# Altium project BEE-1012 PAY-IF V110.PrjPcb (part 8 of 8)
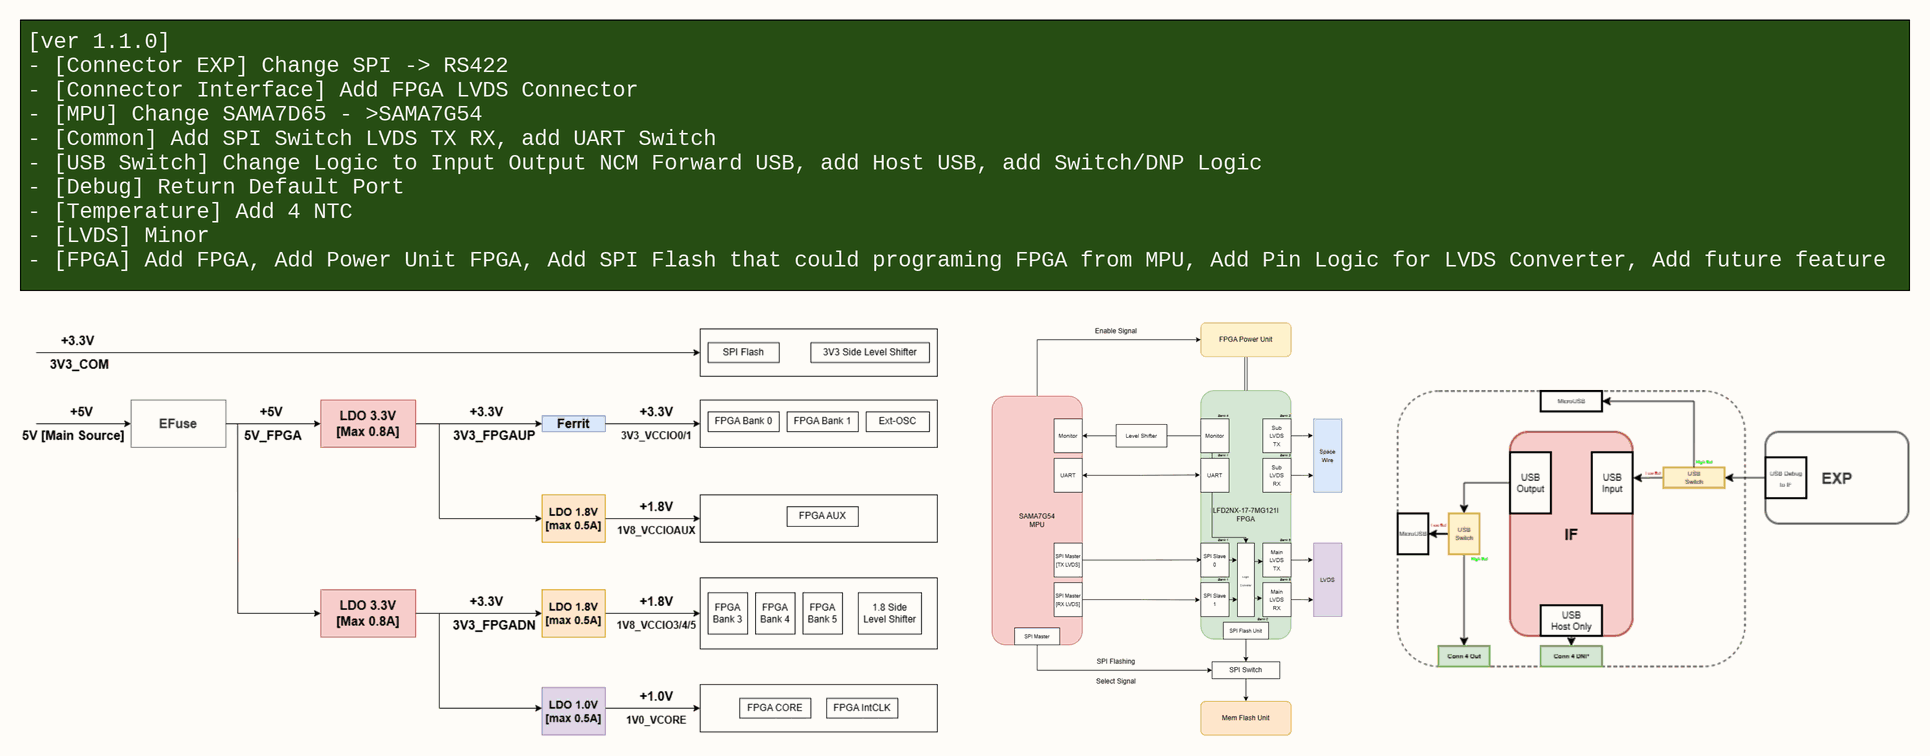
[diagram p41: ChangeNote.SchDoc]

## Nets that join several sheets
1V8_VCCAUX: FPGA_POWER (11 pins), FPGA_PART1 (U35.C6 U35.D9 U35.F3), FPGA_PART2 (U35.H3 U35.H8)
1V8_VCCIO3/4/5: FPGA_POWER (10 pins), FPGA_PART1 (U35.E8), FPGA_PART2 (8 pins)
1V_VCORE: FPGA_POWER (9 pins), FPGA_PART1 (U35.E4 U35.G6), FPGA_PART2 (U35.C10)
3.3_VBAT: Power (C184.1 J11.1), SAMA7G54_MPU (R34.1), RTC (C154.2 U15.9)
3V3_COM: Power (C186.2 R256.2 U28.2 U28.4), CONNECTOR_INTERFACE (11 pins), COMM (10 pins), USB_SWITCH (C172.2 C173.2 U24.1 U25.1), DEBUG_CONSOLE (C138.2 J10.1 R193.1 R194.1), TEMP (12 pins), RTC (7 pins), WATCHDOG (C155.2 U16.1), LVDS (12 pins), CAN_PHY (6 pins), IMU (9 pins), RS422 (6 pins), FPGA_PART2 (C234.2 U37.23 U37.24), FPGA_extFLASH (11 pins)
3V3_eMMC: Power (C188.2 R257.2 U29.2 U29.4), SDCARD_FLASH (14 pins), eMMC (38 pins)
3V3_VCCIO0/1: FPGA_POWER (5 pins), FPGA_PART1 (11 pins), FPGA_PART2 (C233.2 FB2.2 R354.2), FPGA_extFLASH (5 pins)
5V: Power (10 pins), SAMA7G54_PMIC (13 pins), SAMA7G54_PIO (R152.1), USB_SWITCH (SB4.1), FPGA_POWER (6 pins)
5V_FPGA: POWER_MEASUREMENT (R388.2), FPGA_POWER (C193.2 C237.2 U31.3 U40.3)
5V_FPGA_efuse: POWER_MEASUREMENT (R388.1), FPGA_POWER (8 pins)
12V: Power (C181.2 U27.7), POWER_MEASUREMENT (R387.2)
12V_CONN: Power (8 pins), CONNECTOR_EXP (J2-2.1 J2-2.2 J2-2.3)
12V_efuse: Power (8 pins), POWER_MEASUREMENT (R387.1)
GND: Power (36 pins), POWER_MEASUREMENT (6 pins), CONNECTOR_EXP (7 pins), CONNECTOR_INTERFACE (30 pins), SAMA7G54_PMIC (30 pins), SAMA7G54_MPU (115 pins), SAMA7G54_PIO (10 pins), SAMA7G54_DDR3L (84 pins), SDCARD_FLASH (13 pins), eMMC (30 pins), COMM (12 pins), USB_SWITCH (11 pins), DEBUG_CONSOLE (20 pins), TEMP (23 pins), RTC (C153.1 C154.1 U15.6), WATCHDOG (C155.1 R216.2 R217.2 U16.2), LVDS (12 pins), CAN_PHY (10 pins), IMU (9 pins), RS422 (6 pins), BUTTON_LED (D3.1 D4.1 D5.1), MOUNTING_HOLE (12 pins), FPGA_POWER (60 pins), FPGA_PART1 (16 pins), FPGA_PART2 (26 pins), FPGA_extFLASH (6 pins)
VDD_3V3: POWER_MEASUREMENT (11 pins), SAMA7G54_PMIC (18 pins), SAMA7G54_MPU (7 pins), SAMA7G54_PIO (8 pins), SDCARD_FLASH (C130.2 DNP/U6.8 JP9.1 R174.2)
VDD_3V3_MPU: SAMA7G54_PMIC (5 pins), SAMA7G54_MPU (36 pins)
VDDCORE: SAMA7G54_PMIC (R12.2 TP3.0), SAMA7G54_MPU (30 pins)
VDDCPU: SAMA7G54_PMIC (R15.2 TP5.0), SAMA7G54_MPU (11 pins)
VDDIODDR: SAMA7G54_PMIC (R18.2 TP10.0), SAMA7G54_DDR3L (73 pins)
_PD09: SAMA7G54_PMIC (R11.1 U1.1), SAMA7G54_PIO (U3.D19)
ADC_TEMP1: SAMA7G54_PIO (R103.1), TEMP (C149.2 R202.2)
ADC_TEMP2: SAMA7G54_PIO (R105.1), TEMP (C145.2 R196.2)
ADC_TEMP3: SAMA7G54_PIO (R145.1), TEMP (C146.2 R197.2)
ADC_TEMP4: SAMA7G54_PIO (R146.1), TEMP (C152.2 R203.2)
ADC_TEMP_1: SAMA7G54_PIO (R144.1), TEMP (C140.2 R195.2)
BNO_INT: SAMA7G54_PIO (R395.1), IMU (U41.14)
CAN_AX_H: CONNECTOR_INTERFACE (J12.07 R264.1), CAN_PHY (R226#1.1 U22#1.7)
CAN_AX_L: CONNECTOR_INTERFACE (J12.08 R263.1), CAN_PHY (R228#1.2 U22#1.6)
CAN_H_main: CONNECTOR_EXP (J2-2.9), CONNECTOR_INTERFACE (H1.03 R264.2), CAN_PHY (R222.1 U21.7)
CAN_L_main: CONNECTOR_EXP (J2-2.8), CONNECTOR_INTERFACE (H1.01 R263.2), CAN_PHY (R224.2 U21.6)
COM_UART_RX: SAMA7G54_PIO (R148.1), COMM (U9.3)
COM_UART_SEL_CHANNEL_A: SAMA7G54_PIO (R92.1), COMM (R182.1 U9.10)
COM_UART_SEL_CHANNEL_B: SAMA7G54_PIO (R84.1), COMM (R183.1 U9.9)
COM_UART_TX: SAMA7G54_PIO (R147.1), COMM (U9.13)
eFUSE_ILIM_5V_FPGA: SAMA7G54_PIO (R138.1), FPGA_POWER (R313.2 U30.9)
EXP_2_CONN_USB_N: CONNECTOR_EXP (R262.2), CONNECTOR_INTERFACE (R295.1)
EXP_2_CONN_USB_P: CONNECTOR_EXP (R261.2), CONNECTOR_INTERFACE (R296.1)
EXP_2_IF_USB_N: CONNECTOR_EXP (R260.2), USB_SWITCH (U25.4)
EXP_2_IF_USB_P: CONNECTOR_EXP (R259.2), USB_SWITCH (U25.3)
FLASH_SPI_MD2: FPGA_PART1 (U35.C5), FPGA_extFLASH (R373.1)
FLASH_SPI_MD3: FPGA_PART1 (U35.C9), FPGA_extFLASH (R372.2)
FPGA_DOWNLOAD_DONE: SAMA7G54_PIO (R87.1), FPGA_PART2 (U35.D10), FPGA_extFLASH (R363.1 R364.2)
FPGA_DOWNLOAD_INITN: SAMA7G54_PIO (R79.1), FPGA_PART1 (U35.B4), FPGA_extFLASH (D23.1 R365.2)
FPGA_DOWNLOAD_PROGRAMN: SAMA7G54_PIO (R82.1), FPGA_PART1 (U35.C4), FPGA_extFLASH (R362.1)
FPGA_FLASH_SPI_MCLK: FPGA_PART2 (U35.D11), FPGA_extFLASH (U39.6)
FPGA_FLASH_SPI_MCSN: FPGA_PART1 (U35.D7), FPGA_extFLASH (R376.1 U39.3)
FPGA_FLASH_SPI_MISO/MD1: FPGA_PART1 (U35.D5), FPGA_extFLASH (U39.13)
FPGA_FLASH_SPI_MOSI/MD0: FPGA_PART1 (U35.D6), FPGA_extFLASH (U39.10)
FPGA_LVDS_RXC_N: CONNECTOR_INTERFACE (J15.9), FPGA_PART1 (R329.1 R330.1)
FPGA_LVDS_RXC_P: CONNECTOR_INTERFACE (J15.8), FPGA_PART1 (R329.2 R331.1)
FPGA_LVDS_RXD_N: CONNECTOR_INTERFACE (J15.4), FPGA_PART1 (R334.1 R335.2)
FPGA_LVDS_RXD_P: CONNECTOR_INTERFACE (J15.3), FPGA_PART1 (R333.1 R335.1)
FPGA_LVDS_TXC_N: CONNECTOR_INTERFACE (J15.7), FPGA_PART1 (R332.1)
FPGA_LVDS_TXC_P: CONNECTOR_INTERFACE (J15.6), FPGA_PART1 (R336.1)
FPGA_LVDS_TXD_N: CONNECTOR_INTERFACE (J15.2), FPGA_PART1 (R338.1)
FPGA_LVDS_TXD_P: CONNECTOR_INTERFACE (J15.1), FPGA_PART1 (R337.1)
FPGA_SPI_RX_CLK: COMM (U11.6), FPGA_PART1 (U35.C2)
FPGA_SPI_RX_MISO: COMM (U11.13), FPGA_PART1 (U35.D1)
FPGA_SPI_RX_MOSI: COMM (U11.10), FPGA_PART1 (U35.B2)
FPGA_SPI_TX_CLK: COMM (U10#1.6), FPGA_PART1 (U35.E1)
FPGA_SPI_TX_MISO: COMM (U10#1.13), FPGA_PART1 (U35.F1)
FPGA_SPI_TX_MOSI: COMM (U10#1.10), FPGA_PART1 (U35.E2)
FPGA_UART_RX: SAMA7G54_PIO (R139.1), FPGA_PART1 (U35.D8)
FPGA_UART_TX: SAMA7G54_PIO (R141.1), FPGA_PART1 (U35.C3)
I2C_SCL_EXP_PC104: CONNECTOR_EXP (J2-1.6), CONNECTOR_INTERFACE (R292.1 R380.1)
I2C_SDA_EXP_PC104: CONNECTOR_EXP (J2-1.5), CONNECTOR_INTERFACE (R289.1 R379.1)
IF_OUT_CONN_USB_N: CONNECTOR_INTERFACE (R291.1), USB_SWITCH (U24.6)
IF_OUT_CONN_USB_P: CONNECTOR_INTERFACE (R294.1), USB_SWITCH (U24.7)
LPM: SAMA7G54_PMIC (Q1.1 R3.1 R401.1), SAMA7G54_MPU (R402.1)
LVDS_SPI_RX_CLK: SAMA7G54_PIO (R101.1), COMM (U11.7)
LVDS_SPI_RX_CSN: SAMA7G54_PIO (R42.1), COMM (U11.4)
LVDS_SPI_RX_MISO: SAMA7G54_PIO (R45.1), COMM (U11.12)
LVDS_SPI_RX_MOSI: SAMA7G54_PIO (R47.1), COMM (U11.9)
LVDS_SPI_TX_CLK: SAMA7G54_PIO (R54.1), COMM (U10#1.7)
LVDS_SPI_TX_CSN: SAMA7G54_PIO (R57.1), COMM (U10#1.4)
LVDS_SPI_TX_MISO: SAMA7G54_PIO (R51.1), COMM (U10#1.12)
LVDS_SPI_TX_MOSI: SAMA7G54_PIO (R48.1), COMM (U10#1.9)
MCP16502_HPM: SAMA7G54_PMIC (R4.1), SAMA7G54_PIO (R78.1 R152.2 R155.1)
NetC72_1: SAMA7G54_PMIC (U1.24), SAMA7G54_MPU (C72.1 JP3.1)
NetC75_2: SAMA7G54_PMIC (R10.1 U1.2), SAMA7G54_MPU (R37.1 U3.J7), SAMA7G54_PIO (C75.2 R154.1), WATCHDOG (R213.2), IMU (U41.11)
NetD8_1: Power (D8.1 R248.1 U26.1), CONNECTOR_EXP (R258.2), CONNECTOR_INTERFACE (D15.1)
NetJ12_05: CONNECTOR_INTERFACE (J12.05 R297.1), SAMA7G54_PIO (R129.1)
NetJ12_06: CONNECTOR_INTERFACE (J12.06 R298.1), SAMA7G54_PIO (R131.1)
NetQ1_3: SAMA7G54_PMIC (Q1.3 R16.2), SAMA7G54_MPU (Y2.1)
NetR7_2: SAMA7G54_PMIC (R7.2 U2.1), SAMA7G54_PIO (R118.1)
NetR64_1: SAMA7G54_PIO (R64.1), RTC (R209.2 U15.7)
NetR67_1: SAMA7G54_PIO (R67.1), WATCHDOG (R214.2)
NetR91_1: CONNECTOR_INTERFACE (R268.2), SAMA7G54_PIO (R91.1)
NetR95_1: CONNECTOR_INTERFACE (R301.1), SAMA7G54_PIO (R95.1)
NetR96_1: CONNECTOR_INTERFACE (R300.1), SAMA7G54_PIO (R96.1)
NetR97_1: CONNECTOR_INTERFACE (R303.1), SAMA7G54_PIO (R97.1)
NetR98_1: CONNECTOR_INTERFACE (R304.1), SAMA7G54_PIO (R98.1)
NetR111_1: SAMA7G54_PIO (R111.1), WATCHDOG (R215.2)
NetR116_1: SAMA7G54_PIO (R116.1), RTC (R208.2 U15.3)
NetR136_1: Power (R250.1 U26.9), SAMA7G54_PIO (R136.1)
NetR140_1: CONNECTOR_INTERFACE (R290.2 R299.1 R382.1), SAMA7G54_PIO (R140.1)
NetR142_1: CONNECTOR_INTERFACE (R293.2 R302.1 R383.1), SAMA7G54_PIO (R142.1)
NetR385_2: POWER_MEASUREMENT (R385.2 U42.1), SAMA7G54_PIO (R396.1)
NetU10#1_5: COMM (U10#1.5), LVDS (U18.5)
NetU10#1_11: COMM (U10#1.11), LVDS (U17.5)
NetU11_5: COMM (U11.5), LVDS (U20.5)
NetU11_14: COMM (U11.14), LVDS (U19.5)
OSC_LVDS_ENABLE: FPGA_PART1 (U35.B3), FPGA_PART2 (R354.1 U36.1)
PHY_LVDS_RXC_N: CONNECTOR_INTERFACE (J5.9), LVDS (R221.2 U20.4)
PHY_LVDS_RXC_P: CONNECTOR_INTERFACE (J5.8), LVDS (R221.1 U20.3)
PHY_LVDS_RXD_N: CONNECTOR_INTERFACE (J5.4), LVDS (R220.2 U19.4)
PHY_LVDS_RXD_P: CONNECTOR_INTERFACE (J5.3), LVDS (R220.1 U19.3)
PHY_LVDS_TXC_N: CONNECTOR_INTERFACE (J5.7), LVDS (U18.3)
PHY_LVDS_TXC_P: CONNECTOR_INTERFACE (J5.6), LVDS (U18.4)
PHY_LVDS_TXD_N: CONNECTOR_INTERFACE (J5.2), LVDS (U17.3)
PHY_LVDS_TXD_P: CONNECTOR_INTERFACE (J5.1), LVDS (U17.4)
POW_ONOFF_FPGA: SAMA7G54_PIO (R43.1), FPGA_POWER (R305.2 R310.1 U30.1)
RS_422_2_PC104_RX_N: CONNECTOR_EXP (J2-1.2), CONNECTOR_INTERFACE (R276.1 R277.1 R285.1)
RS_422_2_PC104_RX_P: CONNECTOR_EXP (J2-1.1), CONNECTOR_INTERFACE (R274.1 R278.1 R286.2)
RS_422_2_PC104_TX_N: CONNECTOR_EXP (J2-1.4), CONNECTOR_INTERFACE (R272.1 R273.1)
RS_422_2_PC104_TX_P: CONNECTOR_EXP (J2-1.3), CONNECTOR_INTERFACE (R270.1 R271.1)
RS_422_RX_N: CONNECTOR_INTERFACE (R267.1 R276.2), RS422 (R236.2 SB3.1 U23.10)
RS_422_RX_P: CONNECTOR_INTERFACE (R269.1 R278.2), RS422 (R236.1 SB2.1 U23.11)
RS_422_TX_N: CONNECTOR_INTERFACE (R266.1 R273.2), RS422 (R237.1 SB3.2 U23.9)
RS_422_TX_P: CONNECTOR_INTERFACE (R265.1 R271.2), RS422 (R237.2 SB2.2 U23.8)
SAM_BNO_RX: COMM (U9.4), IMU (U41.20)
SAM_BNO_TX: COMM (U9.11), IMU (U41.19)
SAM_HOST_UART_RXD: CONNECTOR_INTERFACE (J14#1.11), COMM (U9.1)
SAM_HOST_UART_TXD: CONNECTOR_INTERFACE (J14#1.12), COMM (U9.12)
SAM_OEM719_PPS: CONNECTOR_INTERFACE (J14#1.19 R275.2), SAMA7G54_PIO (R83.1)
SAM_OEM719_UART_RX: CONNECTOR_INTERFACE (J14#1.14 R287.1), COMM (U9.5)
SAM_OEM719_UART_TX: CONNECTOR_INTERFACE (J14#1.15 R288.1), COMM (U9.14)
SAM_RTC_I2C_SCL: POWER_MEASUREMENT (R80#1.2 U42.4), SAMA7G54_PMIC (R1.2 U1.6 U2.4), SAMA7G54_PIO (R121.1), RTC (R211.2 U15.4)
SAM_RTC_I2C_SDA: POWER_MEASUREMENT (R218#1.2 U42.5), SAMA7G54_PMIC (R2.2 U1.5 U2.5), SAMA7G54_PIO (R120.1), RTC (R212.2 U15.5)
SAMA7_FLASH_SPI_FPGA_SEL: SAMA7G54_PIO (R85.1), FPGA_extFLASH (R377.1 U39.1)
SAMA7_FLASH_SPI_MCLK: SAMA7G54_PIO (R56.1), FPGA_extFLASH (U39.5)
SAMA7_FLASH_SPI_MCSN: SAMA7G54_PIO (R59.1), FPGA_extFLASH (R375.1 U39.2)
SAMA7_FLASH_SPI_MISO/MD1: SAMA7G54_PIO (R53.1), FPGA_extFLASH (U39.14)
SAMA7_FLASH_SPI_MOSI/MD0: SAMA7G54_PIO (R50.1), FPGA_extFLASH (U39.11)
SAMA7_FPGA_HEATBEAT: SAMA7G54_PIO (R114.1), FPGA_PART2 (R359.2 U37.14)
SAMA7_FPGA_INT_ERROR: SAMA7G54_PIO (R113.1), FPGA_PART2 (U37.15)
SAMA7_LVDS_SPI_RX_SEL: SAMA7G54_PIO (R86.1), COMM (R187.1 U11.1)
SAMA7_LVDS_SPI_TX_SEL: SAMA7G54_PIO (R88.1), COMM (R185.1 U10#1.1)
SAMA7_SPARE_IN1: SAMA7G54_PIO (R134.1), FPGA_PART2 (U37.19)
SAMA7_SPARE_IN2: SAMA7G54_PIO (R117.1), FPGA_PART2 (U37.18)
SAMA7_SPI_RX_AVAIL: SAMA7G54_PIO (R110.1), FPGA_PART2 (U37.16)
SAMA7_SPI_RX_CSN: COMM (R188.1 U11.3), FPGA_PART2 (U37.20)
SAMA7_SPI_TX_CSN: COMM (R186.1 U10#1.3), FPGA_PART2 (U37.21)
SAMA7_SPI_TX_READY: SAMA7G54_PIO (R107.1), FPGA_PART2 (U37.17)
SD2_CLK: SAMA7G54_PIO (R100.1), SDCARD_FLASH (J7.P5 R180.1 U7.3)
SD2_CMD: SAMA7G54_PIO (R99.1), SDCARD_FLASH (J7.P3 R181.1 U8.1)
SD2_DATA0: SAMA7G54_PIO (R102.1), SDCARD_FLASH (J7.P7 R177.1 U7.4)
SD2_DATA1: SAMA7G54_PIO (R104.1), SDCARD_FLASH (J7.P8 R176.1 U7.6)
SD2_DATA2: SAMA7G54_PIO (R106.1), SDCARD_FLASH (J7.P1 R178.1 U8.4)
SD2_DATA3: SAMA7G54_PIO (R109.1), SDCARD_FLASH (J7.P2 R179.1 U8.6)
SD2_nCD: SAMA7G54_PIO (R112.1), SDCARD_FLASH (J7.P9 R175.1)
SHDN: SAMA7G54_PMIC (R5.1), SAMA7G54_MPU (U3.R9)
SOM_CANRX0: SAMA7G54_PIO (R127.1), CAN_PHY (U21.4)
SOM_CANRX1: SAMA7G54_PIO (R132.1), CAN_PHY (U22#1.4)
SOM_CANTX0: SAMA7G54_PIO (R125.1), CAN_PHY (U21.1)
SOM_CANTX1: SAMA7G54_PIO (R130.1), CAN_PHY (U22#1.1)
SOM_CONSOLE_RX: SAMA7G54_PIO (R137.1), DEBUG_CONSOLE (J10.3 R194.2)
SOM_CONSOLE_TX: SAMA7G54_PIO (R135.1), DEBUG_CONSOLE (J10.2 R193.2)
SOM_EMMC_nRST: SAMA7G54_PIO (R46.1), eMMC (R171.1 U5.M5)
SOM_MRAM_QSPI_CLK: SAMA7G54_PIO (R77.1), SDCARD_FLASH (DNP/U6.6)
SOM_MRAM_QSPI_IO0: SAMA7G54_PIO (R73.1), SDCARD_FLASH (DNP/U6.5)
SOM_MRAM_QSPI_IO1: SAMA7G54_PIO (R71.1), SDCARD_FLASH (DNP/U6.2)
SOM_MRAM_QSPI_IO2: SAMA7G54_PIO (R69.1), SDCARD_FLASH (DNP/U6.3)
SOM_MRAM_QSPI_IO3: SAMA7G54_PIO (R66.1), SDCARD_FLASH (DNP/U6.7)
SOM_RAM_QSPI_nCS: SAMA7G54_PIO (R75.1), SDCARD_FLASH (R384.1)
SOM_RS422_DE: SAMA7G54_PIO (R150.1), RS422 (R238.2 U23.3)
SOM_RS422_~{RE}: SAMA7G54_PIO (R40.1), RS422 (R234.1 U23.2)
SOM_RS422_RX: SAMA7G54_PIO (R151.1), RS422 (U23.1)
SOM_RS422_TX: SAMA7G54_PIO (R149.1), RS422 (U23.4)
SOM_SDMMC0_CD_PA14: SAMA7G54_PIO (R76.1), eMMC (R173.1)
SOM_SDMMC0_OUT_CK: SAMA7G54_PIO (R41.1), eMMC (R170.1 U5.P6)
SOM_SDMMC0_OUT_CMD: SAMA7G54_PIO (R44.1), eMMC (R169.1 U5.P5)
SOM_SDMMC0_OUT_D0: SAMA7G54_PIO (R49.1), eMMC (R168.1 U5.K2)
SOM_SDMMC0_OUT_D1: SAMA7G54_PIO (R52.1), eMMC (R167#1.1 U5.N2)
SOM_SDMMC0_OUT_D2: SAMA7G54_PIO (R55.1), eMMC (R166#1.1 U5.K3)
SOM_SDMMC0_OUT_D3: SAMA7G54_PIO (R58.1), eMMC (R165.1 U5.N3)
SOM_SDMMC0_OUT_D4: SAMA7G54_PIO (R61.1), eMMC (R164.1 U5.N8)
SOM_SDMMC0_OUT_D5: SAMA7G54_PIO (R62.1), eMMC (R163.1 U5.K8)
SOM_SDMMC0_OUT_D6: SAMA7G54_PIO (R65.1), eMMC (R162.1 U5.N9)
SOM_SDMMC0_OUT_D7: SAMA7G54_PIO (R68.1), eMMC (R161.1 U5.K9)
SOM_SDMMC0_OUT_DS: SAMA7G54_PIO (R70.1), eMMC (U5.K5)
SOM_STATUS_LED_1: SAMA7G54_PIO (R74.1), BUTTON_LED (R231.2)
SOM_STATUS_LED_2: SAMA7G54_PIO (R143.1), BUTTON_LED (R230.2)
SOM_STATUS_LED_3: SAMA7G54_PIO (R63.1), BUTTON_LED (R232.2)
SOM_USER_BUTTON_PA12: SAMA7G54_MPU (R39.1), SAMA7G54_PIO (R72.1)
SubSPW_LVDS_SOUT_P: FPGA_PART1 (R328.1), FPGA_PART2 (J17.6)
USB_DEBUG_N: USB_SWITCH (U24.8), DEBUG_CONSOLE (J9.2)
USB_DEBUG_P: USB_SWITCH (U24.9), DEBUG_CONSOLE (J9.3)
USB_EXP_N: USB_SWITCH (U25.8), DEBUG_CONSOLE (J18.2)
USB_EXP_P: USB_SWITCH (U25.9), DEBUG_CONSOLE (J18.3)
USB_HOST_ONLY_N: SAMA7G54_MPU (U3.B6), USB_SWITCH (J20.2)
USB_HOST_ONLY_P: SAMA7G54_MPU (U3.A6), USB_SWITCH (J20.3)
USBA_N: SAMA7G54_MPU (U3.B3), USB_SWITCH (U24.4)
USBA_P: SAMA7G54_MPU (U3.A3), USB_SWITCH (U24.3)
USBB_N: SAMA7G54_MPU (U3.B4), USB_SWITCH (U25.6)
USBB_P: SAMA7G54_MPU (U3.A4), USB_SWITCH (U25.7)
VBUS_DEBUG: USB_SWITCH (R239.1), DEBUG_CONSOLE (D1.2 J9.1)
VBUS_EXP: USB_SWITCH (R241.1), DEBUG_CONSOLE (D2.2 J18.1)
WKUP: SAMA7G54_PMIC (R9.1 U1.7), SAMA7G54_MPU (U3.AA15)